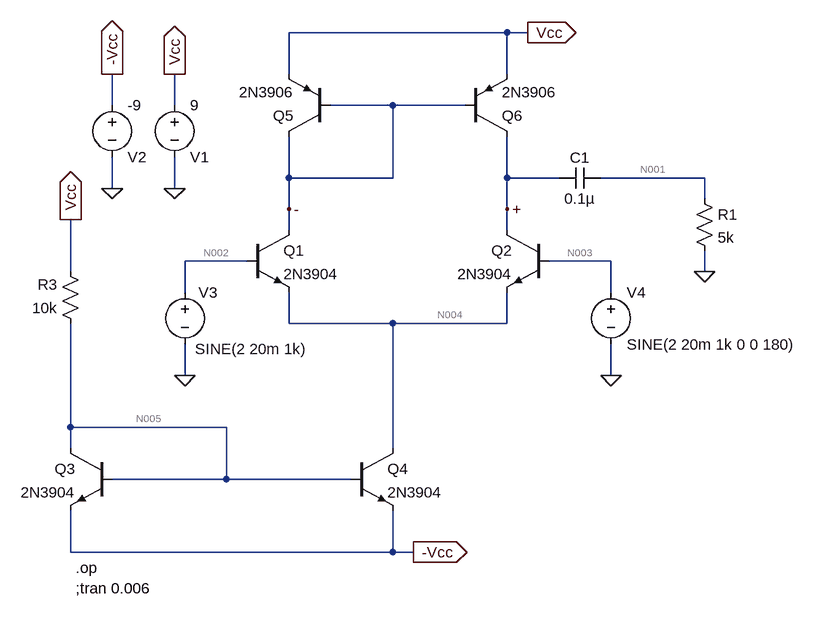
[diagram p0: schematic task.asc]
task.asc, the LTspice schematic file:
Version 4
SHEET 1 880 1000
WIRE 288 -80 -48 -80
WIRE 320 -80 288 -80
WIRE -48 -16 -48 -80
WIRE 288 -16 288 -80
WIRE -320 32 -320 -16
WIRE -224 32 -224 -16
WIRE 112 32 16 32
WIRE 224 32 112 32
WIRE -48 144 -48 80
WIRE 112 144 112 32
WIRE 112 144 -48 144
WIRE 288 144 288 80
WIRE 368 144 288 144
WIRE 592 144 432 144
WIRE -320 160 -320 112
WIRE -224 160 -224 112
WIRE 592 176 592 144
WIRE -48 192 -48 144
WIRE 288 192 288 144
WIRE -48 224 -48 192
WIRE 288 224 288 192
WIRE -112 272 -208 272
WIRE 448 272 352 272
WIRE -384 288 -384 208
WIRE 592 288 592 256
WIRE -208 320 -208 272
WIRE 448 320 448 272
WIRE -48 368 -48 320
WIRE 112 368 -48 368
WIRE 288 368 288 320
WIRE 288 368 112 368
WIRE -208 448 -208 400
WIRE 448 448 448 400
WIRE -384 528 -384 368
WIRE -144 528 -384 528
WIRE -384 560 -384 528
WIRE 112 560 112 368
WIRE -144 608 -144 528
WIRE -144 608 -320 608
WIRE 48 608 -144 608
WIRE -384 720 -384 656
WIRE 112 720 112 656
WIRE 112 720 -384 720
WIRE 144 720 112 720
FLAG -208 448 0
FLAG 448 448 0
FLAG 288 192 +
FLAG -48 192 -
FLAG -224 -16 Vcc
IOPIN -224 -16 Out
FLAG -224 160 0
FLAG -384 208 Vcc
IOPIN -384 208 Out
FLAG 320 -80 Vcc
IOPIN 320 -80 Out
FLAG -320 -16 -Vcc
IOPIN -320 -16 Out
FLAG -320 160 0
FLAG 144 720 -Vcc
IOPIN 144 720 Out
FLAG 592 288 0
SYMBOL res -368 384 R180
WINDOW 0 36 76 Left 2
WINDOW 3 36 40 Left 2
SYMATTR InstName R3
SYMATTR Value 10k
SYMBOL npn 48 560 R0
SYMATTR InstName Q4
SYMATTR Value 2N3904
SYMBOL npn -112 224 R0
SYMATTR InstName Q1
SYMATTR Value 2N3904
SYMBOL npn -320 560 M0
SYMATTR InstName Q3
SYMATTR Value 2N3904
SYMBOL npn 352 224 M0
SYMATTR InstName Q2
SYMATTR Value 2N3904
SYMBOL voltage -208 304 R0
WINDOW 0 21 16 Left 2
WINDOW 3 187 103 Right 2
WINDOW 123 0 0 Left 0
WINDOW 39 0 0 Left 0
SYMATTR InstName V3
SYMATTR Value SINE(2 20m 1k)
SYMBOL voltage -224 16 R0
WINDOW 0 24 96 Left 2
WINDOW 3 24 16 Left 2
WINDOW 123 0 0 Left 0
WINDOW 39 0 0 Left 0
SYMATTR InstName V1
SYMATTR Value 9
SYMBOL voltage 448 304 R0
WINDOW 123 0 0 Left 0
WINDOW 39 0 0 Left 0
SYMATTR InstName V4
SYMATTR Value SINE(2 20m 1k 0 0 180)
SYMBOL pnp 16 80 R180
SYMATTR InstName Q5
SYMATTR Value 2N3906
SYMBOL pnp 224 80 M180
SYMATTR InstName Q6
SYMATTR Value 2N3906
SYMBOL voltage -320 16 R0
WINDOW 0 24 96 Left 2
WINDOW 3 24 16 Left 2
WINDOW 123 0 0 Left 0
WINDOW 39 0 0 Left 0
SYMATTR InstName V2
SYMATTR Value -9
SYMBOL cap 432 128 R90
WINDOW 0 0 32 VBottom 2
WINDOW 3 32 32 VTop 2
SYMATTR InstName C1
SYMATTR Value 0.1µ
SYMBOL res 576 160 R0
SYMATTR InstName R1
SYMATTR Value 5k
TEXT -376 744 Left 2 !.op
TEXT -376 776 Left 2 !;tran 0.006

The netlist it stands for:
* task.asc
R3 N005 Vcc 10k
Q4 N004 N005 -Vcc 0 2N3904
Q1 - N002 N004 0 2N3904
Q3 N005 N005 -Vcc 0 2N3904
Q2 + N003 N004 0 2N3904
V3 N002 0 SINE(2 20m 1k)
V1 Vcc 0 9
V4 N003 0 SINE(2 20m 1k 0 0 180)
Q5 - - Vcc 0 2N3906
Q6 + - Vcc 0 2N3906
V2 -Vcc 0 -9
C1 N001 + 0.1µ
R1 N001 0 5k
.model NPN NPN
.model PNP PNP
.lib standard.bjt
.op
;tran 0.006
.backanno
.end

* Results of the author's LTspice run, read from the files saved beside the schematic
* Operating Point:
*   V(n005) = -8.33 V
*   V(vcc) = 9 V
*   V(n004) = 1.348 V
*   V(-vcc) = -9 V
*   V(-) = 8.346 V
*   V(n002) = 2 V
*   V(+) = 7.83 V
*   V(n003) = 2 V
*   V(n001) = 3.915 fV
*   Ic(Q6) = -938.2 µA
*   Ib(Q6) = -4.678 µA
*   Ie(Q6) = 942.9 µA
*   Ic(Q5) = -933.4 µA
*   Ib(Q5) = -4.678 µA
*   Ie(Q5) = 938.1 µA
*   Ic(Q2) = 938.2 µA
*   Ib(Q2) = 2.962 µA
*   Ie(Q2) = -941.2 µA
*   Ic(Q3) = 1.722 mA
*   Ib(Q3) = 5.763 µA
*   Ie(Q3) = -1.727 mA
*   Ic(Q1) = 942.8 µA
*   Ib(Q1) = 2.962 µA
*   Ie(Q1) = -945.7 µA
*   Ic(Q4) = 1.887 mA
*   Ib(Q4) = 5.759 µA
*   Ie(Q4) = -1.893 mA
*   I(C1) = 0 A
*   I(R1) = 0 A
*   I(R3) = -1.733 mA
*   I(V2) = 3.62 mA
*   I(V4) = -2.962 µA
*   I(V1) = -3.614 mA
*   I(V3) = -2.962 µA